# EasyEDA Pro project RBCTL1V2_V1.3.eprj, board ctl1v2pcb
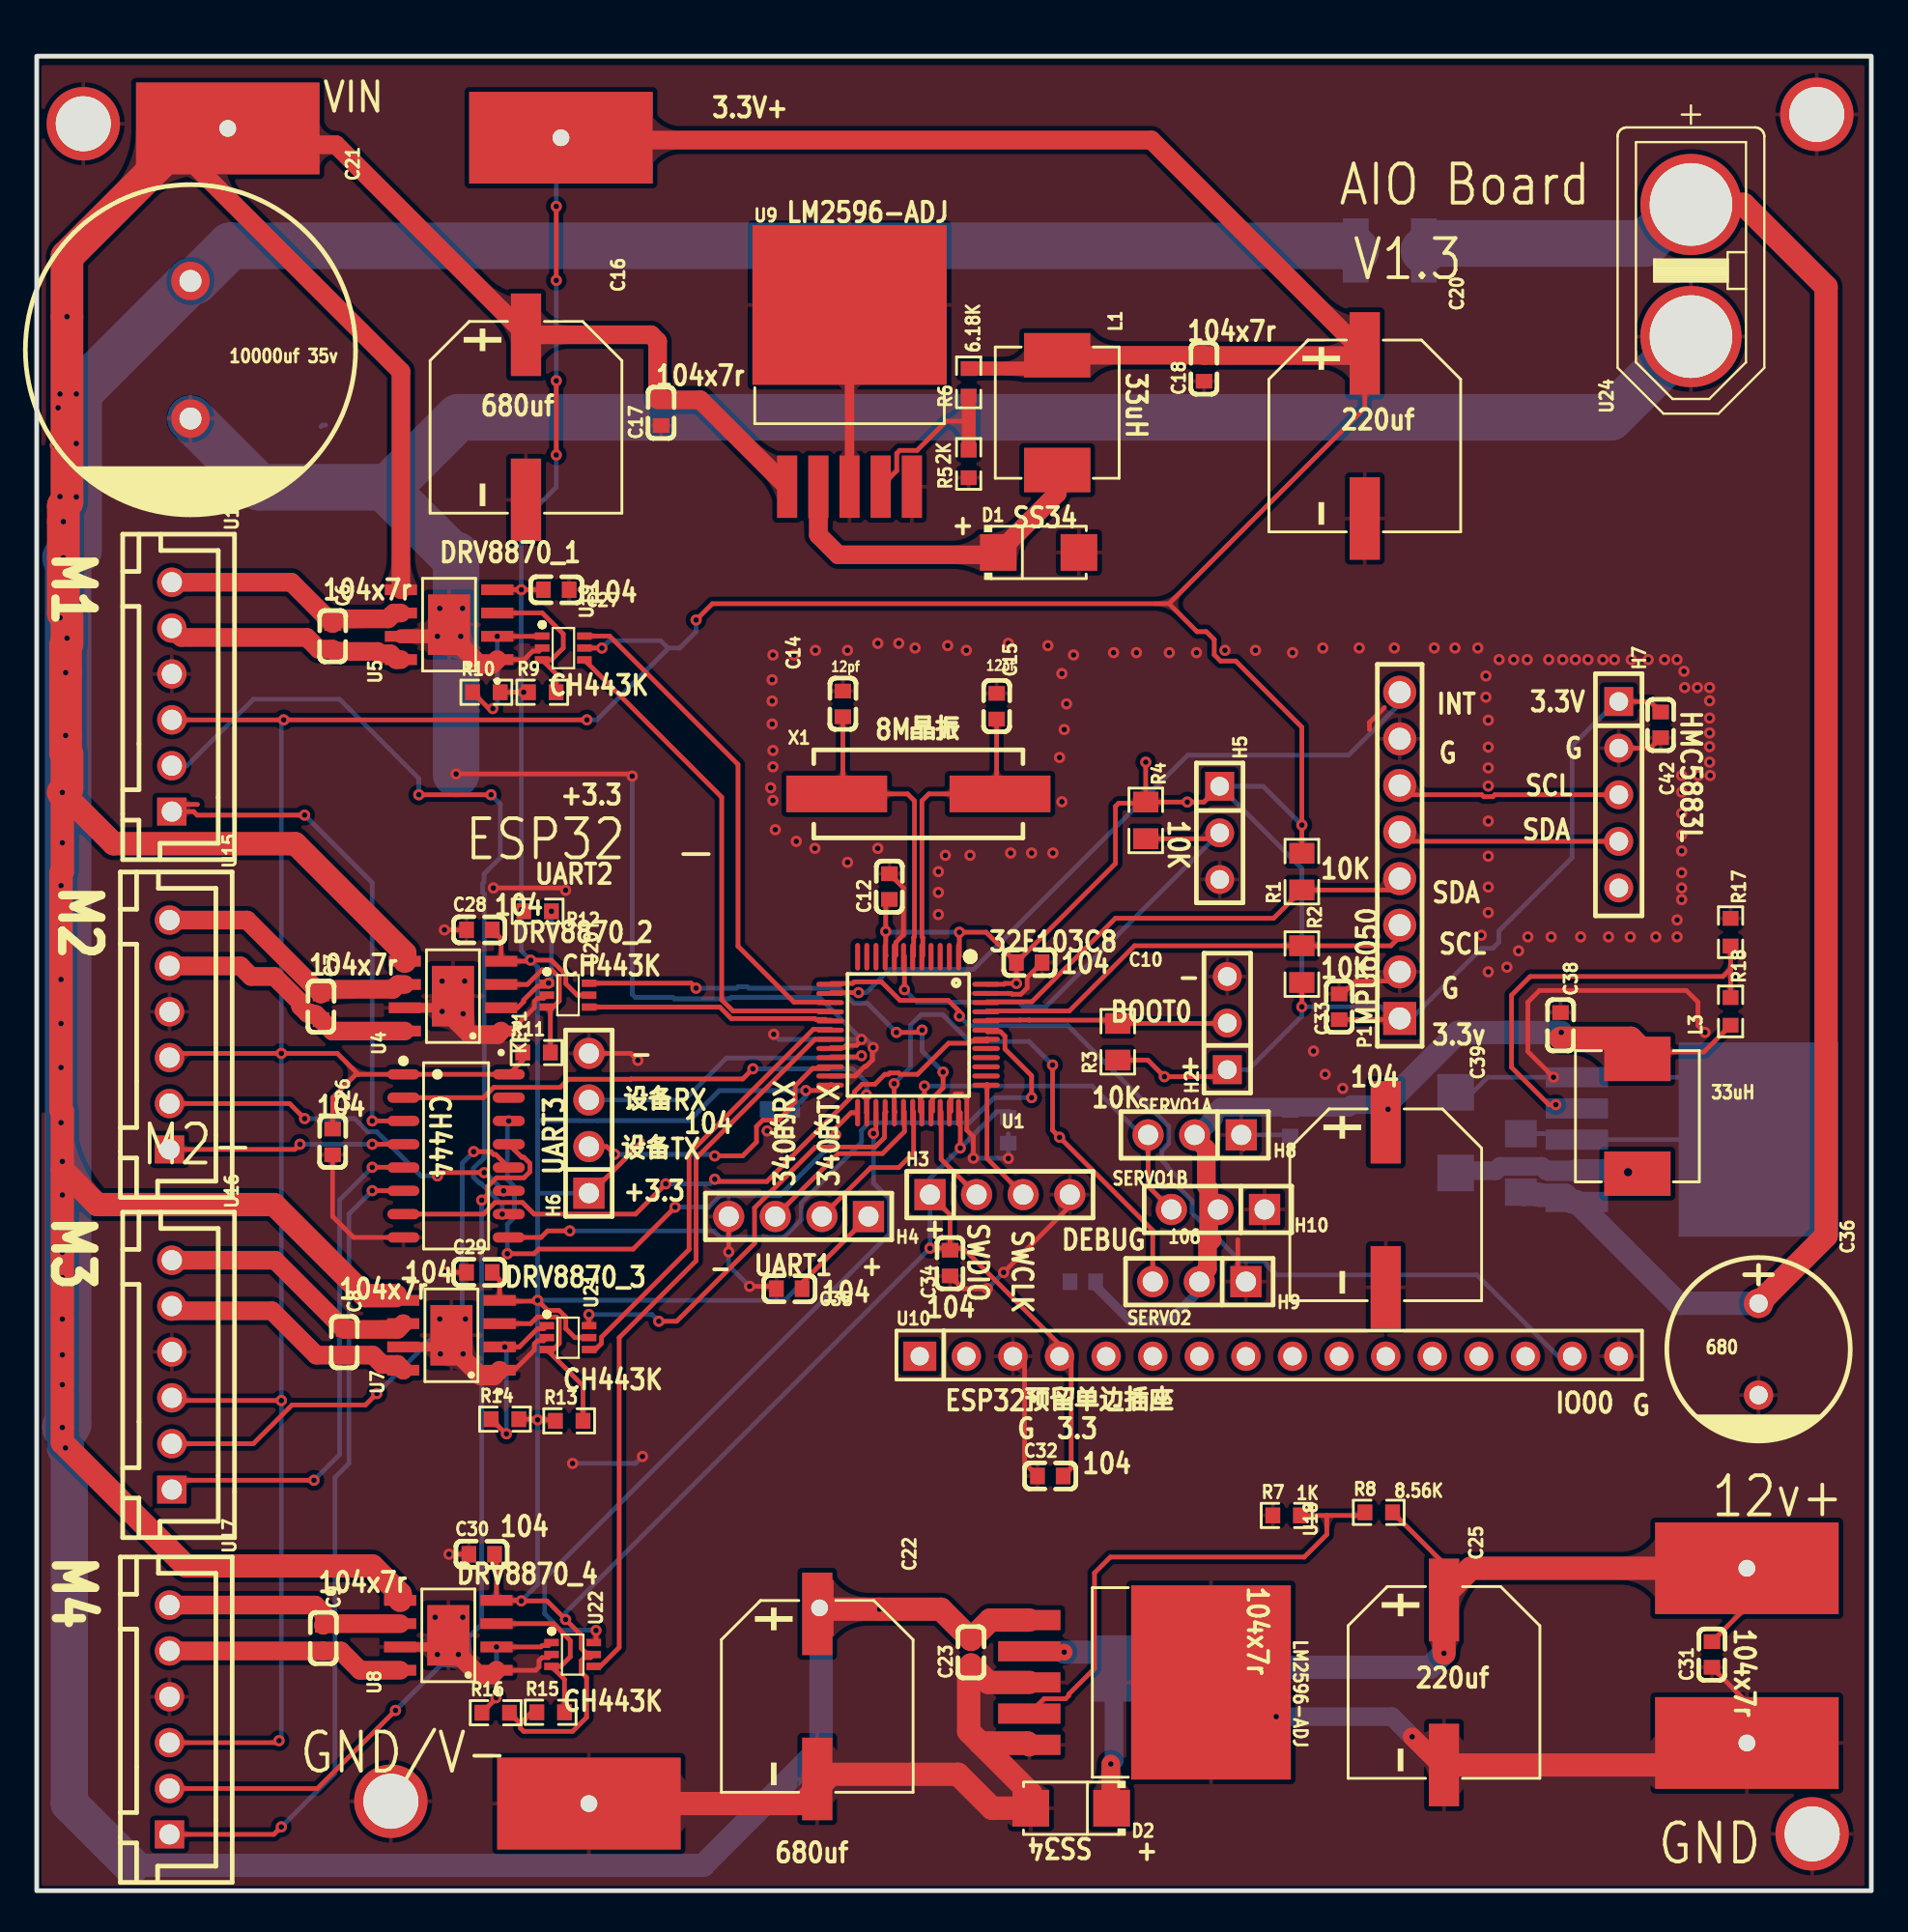
[diagram p1: board, top side]
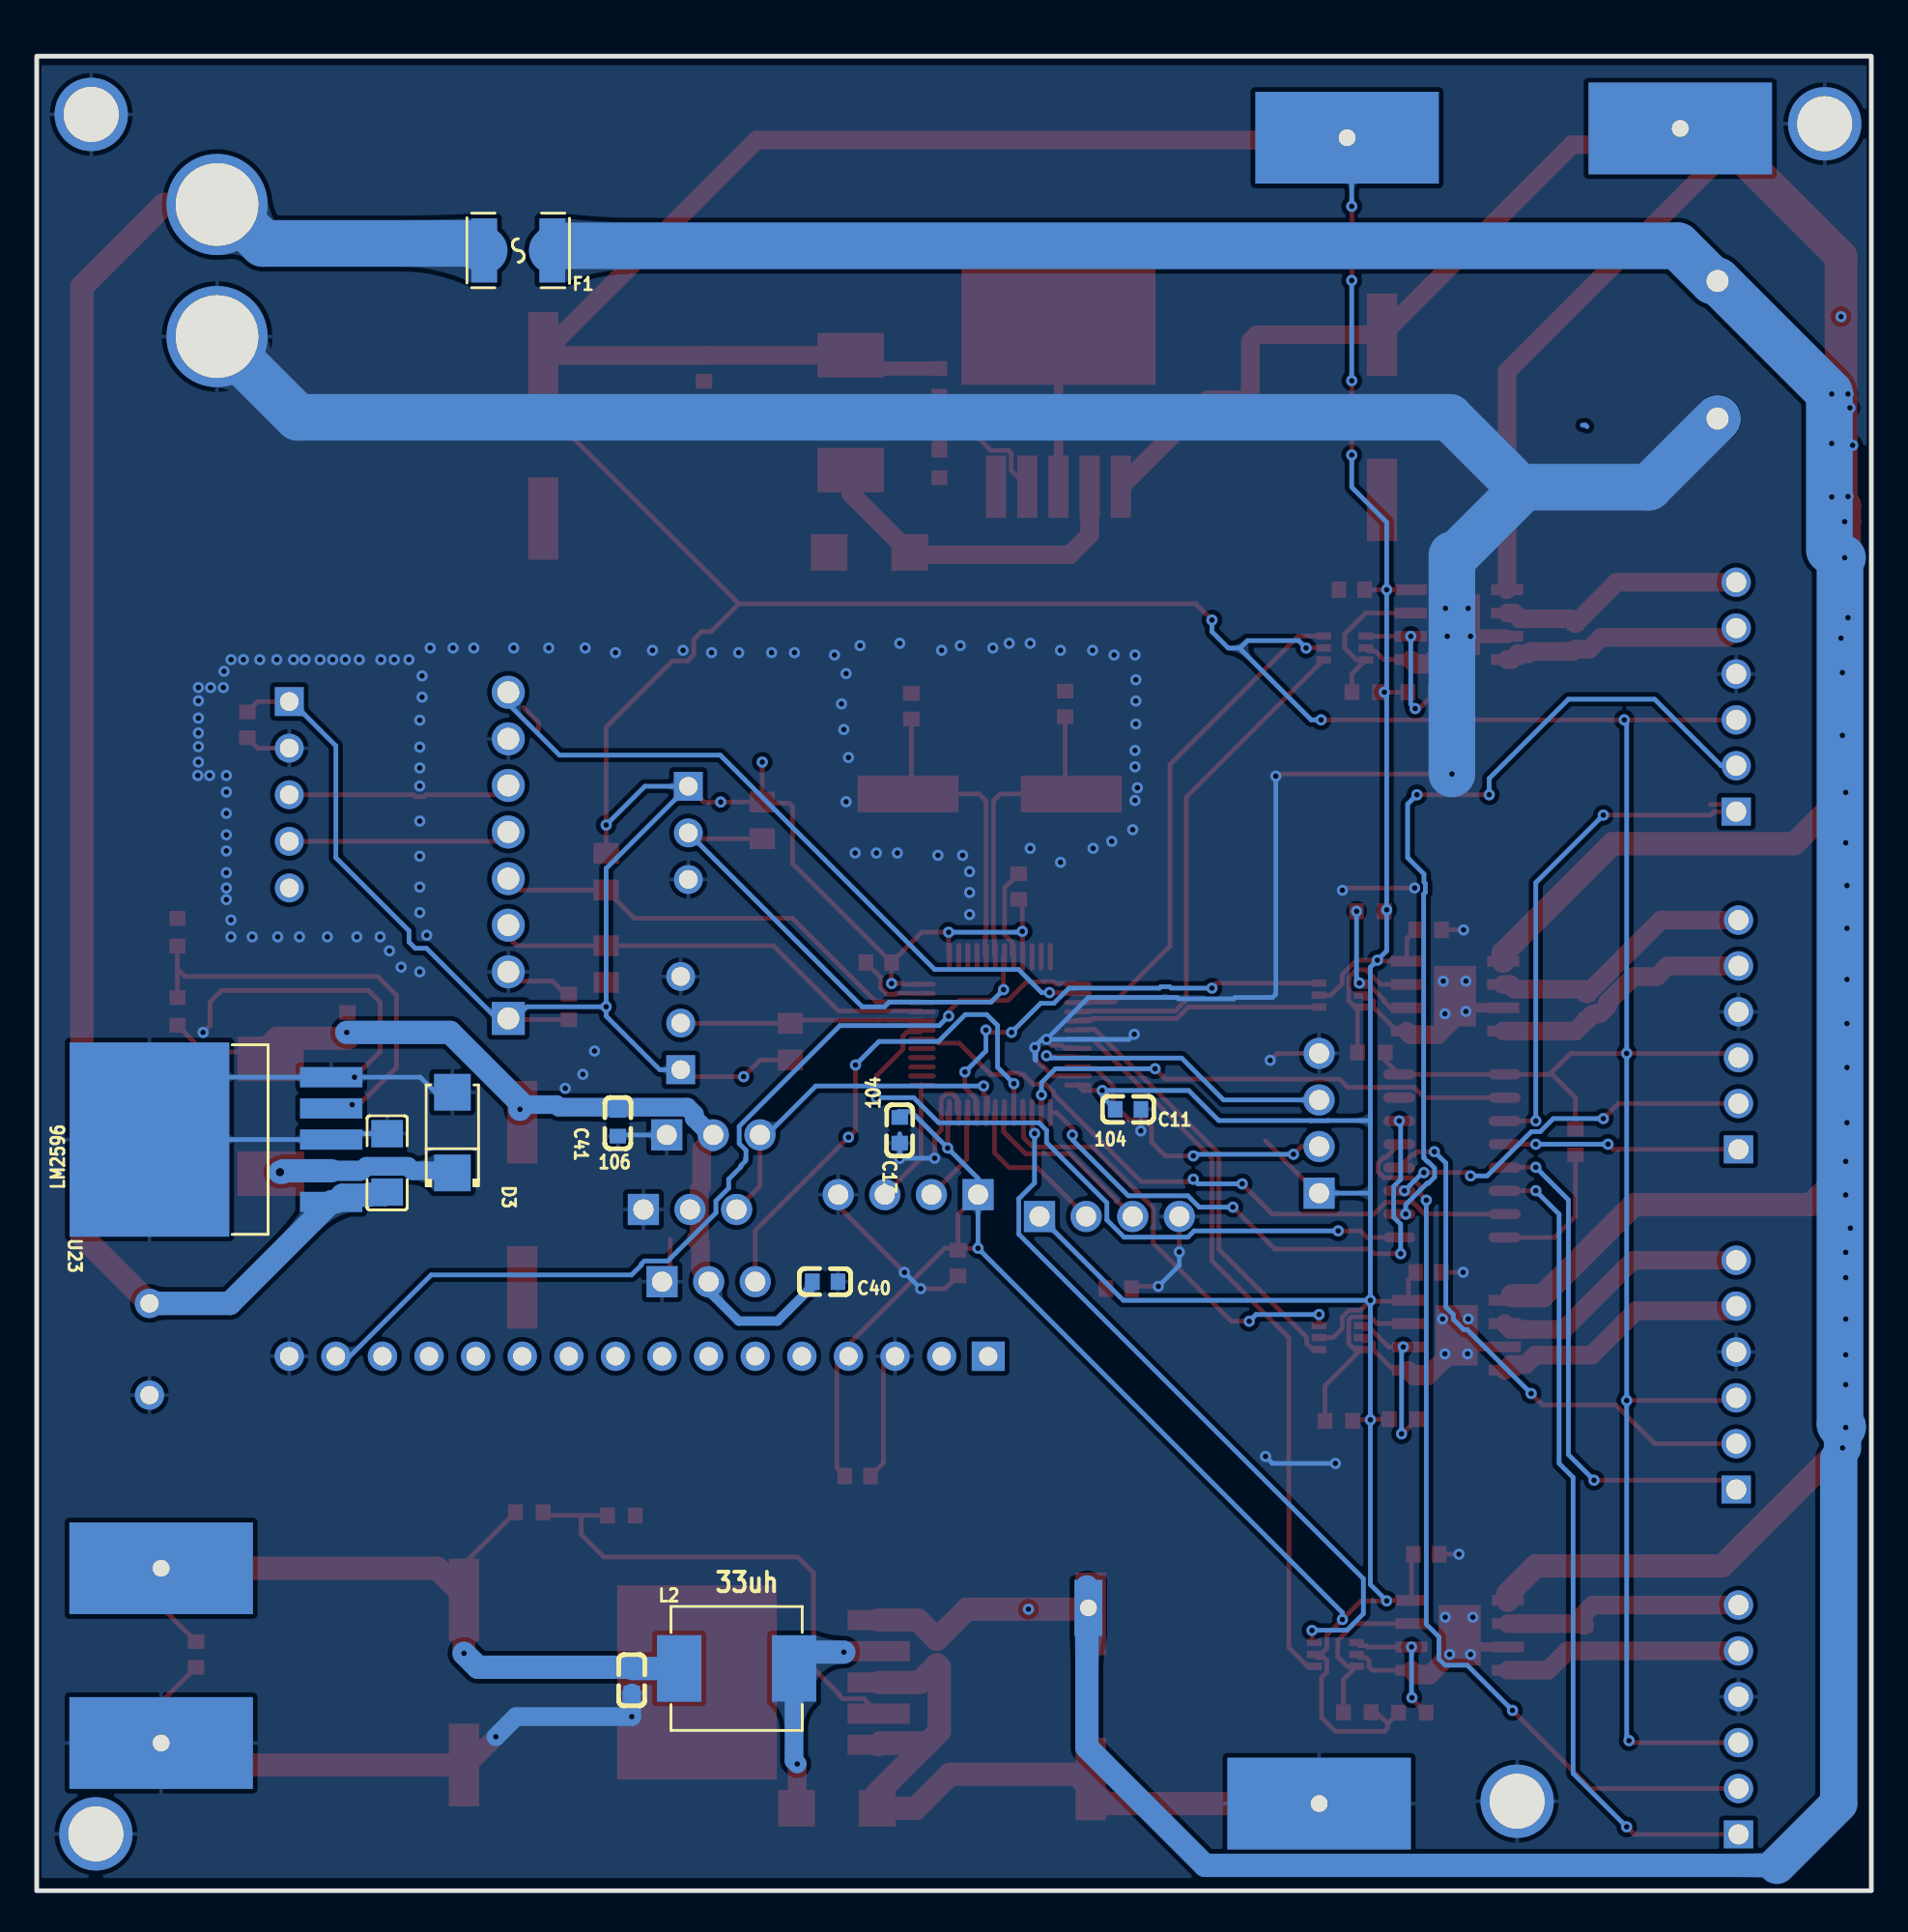
[diagram p2: board, bottom side, seen from below]

Outline 100 x 100 mm; copper layers: Top Layer, Bottom Layer. Coordinates in mm from the lower left corner of the outline.
Outline path: rectangle 0,100 100,0
Stack: Top Layer 0.035mm / Dielectric1 1.51mm FR4 er 4.5 / Bottom Layer 0.035mm

## Design rules (mm)
net $2N1258: DP1
net $2N1262: DP1
template: JLCPCB Capability(Two Layers Board)
spacing copperThickness1oz (default): track to track 0.102, other pairs 0.152 to 0.3
spacing copperThickness2oz: track to track 0.203, other pairs 0.152 to 0.3
track width copperThickness1oz (default): min 0.127, default 0.254, max 2.54
track width copperThickness2oz: min 0.203, default 0.254, max 2.54
differential pair differentialPair (default): width min 0.127, default 0.254, max 2.54; gap min 0.152, default 0.152
via viaSize (default): diameter min 0.5, default 0.61, max 10; hole min 0.3, default 0.305, max 6.3

## Placement (name value [footprint] x y rotation side)
C6  100nF  [C0603]  16.13 68.38 270 top
C7  100nF  [C0603]  15.49 48.18 270 top
C8  100nF  [C0603]  16.76 29.9 270 top
C9  100nF  [C0603]  15.62 13.77 270 top
C10  100nF  [C0603]  54.1 50.6 180 top
C11  100nF  [C0603]  40.51 42.6 0 bottom
C12  100nF  [C0603]  46.48 54.74 90 top
C13  100nF  [C0603]  52.96 41.45 90 bottom
C14  12pF  [C0603]  43.94 64.69 270 top
C15  12pF  [C0603]  52.32 64.57 270 top
C16  680uF  [CAP-SMD_BD10.0-L10.3-W10.3-LS10.9-FD]  26.67 80.31 270 top
C17  100nF  [C0603]  34.04 80.57 90 top
C18  100nF  [C0603]  63.63 82.98 90 top
C20  220uF  [CAP-SMD_BD10.0-L10.3-W10.3-LS10.9-FD]  72.39 79.3 270 top
C21  10000uF  [CAP-TH_BD18.0-P7.50-D0.8-FD]  8.38 84 270 top
C22  680uF  [CAP-SMD_BD10.0-L10.3-W10.3-LS10.9-FD]  42.55 10.59 270 top
C23  100nF  [C0603]  50.93 13 90 top
C24  100nF  [C0603]  67.56 11.48 90 bottom
C25  220uF  [CAP-SMD_BD10.0-L10.3-W10.3-LS10.9-FD]  76.71 11.35 270 top
C26  100nF  [C0603]  16.13 40.82 270 top
C27  100nF  [C0603]  28.32 70.92 180 top
C28  100nF  [C0603]  24.13 52.38 0 top
C29  100nF  [C0603]  24.13 33.71 0 top
C30  100nF  [C0603]  24.26 18.34 0 top
C31  100nF  [C0603]  91.31 12.88 90 top
C32  100nF  [C0603]  55.25 22.61 0 top
C33  100nF  [C0603]  70.99 48.18 270 top
C34  100nF  [C0603]  49.78 34.21 90 top
C35  100nF  [C0603]  41.02 32.82 180 top
C36  680uF  [CAP-TH_BD10.0-P5.00-D0.6-FD]  93.85 29.51 270 top
C37  100nF  [C1206]  80.9 39.67 270 bottom
C38  100nF  [C0603]  83.06 47.17 270 top
C39  220uF  [CAP-SMD_BD10.0-L10.3-W10.3-LS10.9-FD]  73.53 37.39 270 top
C40  10uf  [C0603]  57.02 33.2 180 bottom
C41  10uf  [C0603]  68.33 41.83 270 bottom
C42  100nF  [C0603]  88.52 63.55 90 top
D1  SS34  [SMA_L4.3-W2.6-LS5.2-RD]  54.61 72.95 0 top
D2  SS34  [SMA_L4.3-W2.6-LS5.2-RD]  56.39 4.5 180 top
D3  SS34  [SMA_L4.3-W2.6-LS5.2-RD]  77.34 41.33 90 bottom
F1  15A  [F1812]  73.75 89.41 0 bottom
H2  PM254V-11-03-H85  [HDR-TH_3P-P2.54-V-F]  64.9 47.3 90 top
H3  PZ254V-11-04P  [HDR-TH_4P-P2.54-V-M]  52.5 37.94 0 top
H4  PZ254V-11-04P  [HDR-TH_4P-P2.54-V-M]  41.53 36.75 180 top
H5  PM254V-11-03-H85  [HDR-TH_3P-P2.54-V-F]  64.48 57.66 270 top
H6  PZ254V-11-04P  [HDR-TH_4P-P2.54-V-M]  30.1 41.83 90 top
H7  2.54-1*5P母  [HDR-TH_5P-P2.54-V-F]  86.23 59.74 270 top
H8  PZ254V-11-03P  [HDR-TH_3P-P2.54-V-M]  63.12 41.2 180 top
H9  PZ254V-11-03P  [HDR-TH_3P-P2.54-V-M]  63.37 33.2 180 top
H10  PZ254V-11-03P  [HDR-TH_3P-P2.54-V-M]  64.39 37.14 180 top
KEY1  CH444G  [SOP-16_L10.0-W3.9-P1.27-LS6.0-BL]  22.86 40.06 270 top
L1  33uH  [IND-SMD_L7.0-W6.6_FXL0630]  55.63 80.57 270 top
L2  33uH  [IND-SMD_L7.0-W6.6_FXL0630]  61.85 12.12 180 bottom
L3  33uH  [IND-SMD_L7.0-W6.6_FXL0630]  87.25 42.22 270 top
NOREF  -  [Pad_e30]  30.1 4.75 0 top
NOREF#2  -  [Pad_e2054]  2.54 96.32 0 top
NOREF#3  -  [Pad_e2956]  96.77 3.1 0 top
NOREF#4  -  [Pad_e443]  97.03 96.83 0 top
NOREF#5  -  [Pad_e623]  93.22 17.58 0 top
NOREF#6  -  [Pad_e28]  10.41 96.06 0 top
NOREF#7  -  [Pad_e634]  28.58 95.56 0 top
NOREF#8  -  [Pad_e1183]  42.67 15.42 0 top
NOREF#9  -  [Pad_e2945]  19.3 4.88 0 top
NOREF#10  -  [Pad_e626]  93.22 8.05 0 top
P1  2.54-1*8P母环保  [HDR-TH_8P-P2.54-V-F-1]  74.3 56.44 90 top
R1  10K  [R0805]  68.96 55.55 90 top
R2  10K  [R0805]  68.96 50.51 270 top
R3  10K  [R0805]  58.93 46.28 90 top
R4  10K  [R0805]  60.45 58.34 270 top
R5  2K  [R0603]  50.8 77.78 90 top
R6  6.18K  [R0603]  50.8 82.22 90 top
R7  1K  [R0603]  68.13 20.46 0 top
R8  8.56K  [R0603]  73.15 20.62 0 top
R9  10K  [R0603]  27.56 65.33 0 top
R10  10K  [R0603]  24.51 65.33 0 top
R11  10K  [R0603]  27.25 45.69 0 top
R12  10K  [R0603]  27.31 53.39 180 top
R13  10K  [R0603]  29.02 25.61 0 top
R14  10K  [R0603]  25.53 25.71 0 top
R15  10K  [R0603]  28.02 9.73 0 top
R16  10K  [R0603]  25.02 9.7 0 top
R17  1K  [R0603]  92.33 52.25 270 top
R18  5.1K  [R0603]  92.33 47.93 270 top
U1  STM32F103C8T6  [LQFP-48_L7.0-W7.0-P0.50-LS9.0-BL]  47.5 46.66 180 top
U4  DRV8870DDAR-S  [SOP-8_L4.9-W3.9-P1.27-LS6.0-BL-EP3.3-2]  22.69 48.76 90 top
U5  DRV8870DDAR-S  [SOP-8_L4.9-W3.9-P1.27-LS6.0-BL-EP3.3-2]  22.48 69.01 90 top
U7  DRV8870DDAR-S  [SOP-8_L4.9-W3.9-P1.27-LS6.0-BL-EP3.3-2]  22.61 30.28 90 top
U8  DRV8870DDAR-S  [SOP-8_L4.9-W3.9-P1.27-LS6.0-BL-EP3.3-2]  22.44 13.92 90 top
U9  LM2596S-ADJ  [TO-263-5_L10.2-W8.6-P1.70-LS14.4-BL]  44.31 81.49 0 top
U10  PM254-1-16-Z-8.5  [HDR-TH_16P-P2.54-V-F-A]  67.18 29.13 0 top
U11  ZX-XH2.54-6PZZ  [CONN-TH_6P-P2.50_ZX-XH2.54-6PZZ]  7.37 65.08 270 top
U15  ZX-XH2.54-6PZZ  [CONN-TH_6P-P2.50_ZX-XH2.54-6PZZ]  7.24 46.66 270 top
U16  ZX-XH2.54-6PZZ  [CONN-TH_6P-P2.50_ZX-XH2.54-6PZZ]  7.37 28.12 270 top
U17  ZX-XH2.54-6PZZ  [CONN-TH_6P-P2.50_ZX-XH2.54-6PZZ]  7.24 9.32 270 top
U18  LM2596S-ADJ  [TO-263-5_L10.2-W8.6-P1.70-LS14.4-BL]  59.05 11.35 270 top
U19  CH443K  [SC70-6_L2.1-W1.3-P0.65-LS2.3-BL]  28.7 67.74 270 top
U20  CH443K  [SC70-6_L2.1-W1.3-P0.65-LS2.3-BL]  28.96 48.82 270 top
U21  CH443K  [SC70-6_L2.1-W1.3-P0.65-LS2.3-BL]  28.96 30.15 270 top
U22  CH443K  [SC70-6_L2.1-W1.3-P0.65-LS2.3-BL]  29.21 12.88 270 top
U23  LM2596S-ADJ  [TO-263-5_L10.2-W8.6-P1.70-LS14.4-BL]  88.9 40.94 90 bottom
U24  XT60-F  [CONN-TH_XT60PB-F]  90.17 88.32 90 top
X1  8MHz  [CRYSTAL-SMD_L11.5-W4.8-LS12.7]  48.06 59.79 0 top

## Footprints (pads in the part's own frame, mm; a bottom-side part is the same pattern mirrored in y, then rotated)
C0603
  rect 0.8x0.9 smd: 1(-0.7,0) 2(0.7,0)
C1206
  rect 1.485x1.728 smd: 1(-1.593,0) 2(1.593,0)
CAP-SMD_BD10.0-L10.3-W10.3-LS10.9-FD
  rect 4.5x1.65 smd: 1(-4.5,0) 2(4.5,0)
CAP-TH_BD10.0-P5.00-D0.6-FD
  round 1.6 hole 1: 1(-2.5,0) 2(2.5,0)
CAP-TH_BD18.0-P7.50-D0.8-FD
  round 2.1 hole 1.2: 1(-3.75,0) 2(3.75,0)
CONN-TH_6P-P2.50_ZX-XH2.54-6PZZ
  rect 1.524x1.6 hole 1.1: 1(6.25,0)
  round 1.6 hole 1.1: 2(3.75,0) 3(1.25,0) 4(-1.25,0) 5(-3.75,0) 6(-6.25,0)
CONN-TH_XT60PB-F
  round 5.516 hole 4.505x4.5: +(3.6,0) -(-3.6,0)
CRYSTAL-SMD_L11.5-W4.8-LS12.7
  rect 5.5x2 smd: 1(-4.45,0) 2(4.45,0)
F1812
  rect 1.407x3.499 smd: 1(-1.853,0) 2(1.853,0)
HDR-TH_3P-P2.54-V-F
  rect 1.575x1.575 hole 1.02: 1(-2.54,0)
  round 1.575 hole 1.02: 2(0,0) 3(2.54,0)
HDR-TH_3P-P2.54-V-M
  rect 1.7x1.7 hole 1.1: 1(-2.54,0)
  round 1.7 hole 1.1: 2(0,0) 3(2.54,0)
HDR-TH_4P-P2.54-V-M
  rect 1.7x1.7 hole 1.1: 1(-3.81,0)
  round 1.7 hole 1.1: 2(-1.27,0) 3(1.27,0) 4(3.81,0)
HDR-TH_5P-P2.54-V-F
  rect 1.575x1.575 hole 1.02: 1(-5.08,0)
  round 1.575 hole 1.02: 2(-2.54,0) 3(0,0) 4(2.54,0) 5(5.08,0)
HDR-TH_8P-P2.54-V-F-1
  rect 1.8x1.8 hole 1.2: 1(-8.89,0)
  round 1.8 hole 1.2: 2(-6.35,0) 3(-3.81,0) 4(-1.27,0) 5(1.27,0) 6(3.81,0) 7(6.35,0) 8(8.89,0)
HDR-TH_16P-P2.54-V-F-A
  rect 1.8x1.6 hole 1: 1(-19.05,0)
  round 1.6 hole 1: 2(-16.51,0) 3(-13.97,0) 4(-11.43,0) 5(-8.89,0) 6(-6.35,0) 7(-3.81,0) 8(-1.27,0) 9(1.27,0) 10(3.81,0) 11(6.35,0) 12(8.89,0) 13(11.43,0) 14(13.97,0) 15(16.51,0) 16(19.05,0)
IND-SMD_L7.0-W6.6_FXL0630
  rect 2.424x3.62 smd: 1(3.128,0) 2(-3.128,0)
LQFP-48_L7.0-W7.0-P0.50-LS9.0-BL
  oval 0.27x1.5 smd: 1(-2.75,-4.25) 2(-2.25,-4.25) 3(-1.75,-4.25) 4(-1.25,-4.25) 5(-0.75,-4.25) 6(-0.25,-4.25) 7(0.25,-4.25) 8(0.75,-4.25) 9(1.25,-4.25) 10(1.75,-4.25) 11(2.25,-4.25) 12(2.75,-4.25) 25(2.75,4.25) 26(2.25,4.25) 27(1.75,4.25) 28(1.25,4.25) 29(0.75,4.25) 30(0.25,4.25) 31(-0.25,4.25) 32(-0.75,4.25) 33(-1.25,4.25) 34(-1.75,4.25) 35(-2.25,4.25) 36(-2.75,4.25)
  oval 1.5x0.27 smd: 13(4.25,-2.75) 14(4.25,-2.25) 15(4.25,-1.75) 16(4.25,-1.25) 17(4.25,-0.75) 18(4.25,-0.25) 19(4.25,0.25) 20(4.25,0.75) 21(4.25,1.25) 22(4.25,1.75) 23(4.25,2.25) 24(4.25,2.75) 37(-4.25,2.75) 38(-4.25,2.25) 39(-4.25,1.75) 40(-4.25,1.25) 41(-4.25,0.75) 42(-4.25,0.25) 43(-4.25,-0.25) 44(-4.25,-0.75) 45(-4.25,-1.25) 46(-4.25,-1.75) 47(-4.25,-2.25) 48(-4.25,-2.75)
Pad_e28
  rect 10x5 hole 0.914: 1(0,0)
Pad_e30
  rect 10x5 hole 0.914: 1(0,0)
Pad_e443
  round 4 hole 3: 1(0,0)
Pad_e623
  rect 10x5 hole 0.914: 1(0,0)
Pad_e626
  rect 10x5 hole 0.914: 1(0,0)
Pad_e634
  rect 10x5 hole 0.914: 1(0,0)
Pad_e1183
  rect 1.524x3.048 hole 0.914: 1(0,0)
Pad_e2054
  round 4 hole 3: 1(0,0)
Pad_e2945
  round 4 hole 3: 1(0,0)
Pad_e2956
  round 4 hole 3: 1(0,0)
R0603
  rect 0.806x0.864 smd: 1(-0.753,0) 2(0.753,0)
R0805
  rect 1.133x1.377 smd: 1(-1,0) 2(1,0)
SC70-6_L2.1-W1.3-P0.65-LS2.3-BL
  rect 0.4x0.8 smd: 1(-0.65,-1.15) 2(-0.001,-1.15) 3(0.65,-1.15) 4(0.65,1.15) 5(0,1.15) 6(-0.65,1.15)
SMA_L4.3-W2.6-LS5.2-RD
  rect 2x2 smd: 1(-2.2,0) 2(2.2,0)
SOP-8_L4.9-W3.9-P1.27-LS6.0-BL-EP3.3-2
  rect 0.589x1.75 smd: 1(-1.905,-2.626) 2(-0.635,-2.626) 3(0.635,-2.626) 4(1.905,-2.626) 5(1.905,2.626) 6(0.635,2.626) 7(-0.635,2.626) 8(-1.905,2.626)
  rect 3.3x2.3 smd: 9(0,0)
SOP-16_L10.0-W3.9-P1.27-LS6.0-BL
  oval 0.56x1.745 smd: 1(-4.445,-2.873) 2(-3.175,-2.873) 3(-1.905,-2.873) 4(-0.635,-2.873) 5(0.635,-2.873) 6(1.905,-2.873) 7(3.175,-2.873) 8(4.445,-2.873) 9(4.445,2.873) 10(3.175,2.873) 11(1.905,2.873) 12(0.635,2.873) 13(-0.635,2.873) 14(-1.905,2.873) 15(-3.175,2.873) 16(-4.445,2.873)
TO-263-5_L10.2-W8.6-P1.70-LS14.4-BL
  rect 1.1x3.4 smd: 1(-3.4,-4.953) 2(-1.7,-4.953) 3(0,-4.953) 4(1.7,-4.953) 5(3.4,-4.953)
  rect 10.587x8.705 smd: 6(0,4.953)

## Nets
As in the schematic, except:
GND: C10.1 C11.1 C12.2 C13.1 C14.1 C15.1 C16.2 C17.1 C18.1 C20.2 C21.2 C22.2 C23.1 C24.1 C25.2 C26.2 C27.1 C28.1 C29.1 C30.1 C31.1 C32.1 C33.1 C34.1 C35.2 C36.2 C37.1 C38.1 C39.2 C40.2 C41.2 C42.1 D1.2 D2.2 D3.2 H2.3 H3.4 H4.4 H5.3 H6.4 H7.2 H8.1 H9.1 H10.1 KEY1.8 NOREF.1 NOREF#2.1 NOREF#3.1 NOREF#4.1 NOREF#9.1 NOREF#10.1 P1.2 P1.7 R5.1 R7.1 R17.1 U1.8 U1.20 U1.23 U1.35 U1.47 U4.1 U4.7 U4.9 U5.1 U5.7 U5.9 U7.1 U7.7 U7.9 U8.1 U8.7 U8.9 U9.3 U9.5 U9.6 U10.3 U10.16 U11.4 U15.4 U16.4 U17.4 U18.3 U18.5 U18.6 U19.2 U20.2 U21.2 U22.2 U23.3 U23.5 U23.6 U24.-
VCC12: C24.2 C25.1 C31.2 L2.2 NOREF#5.1 R8.2
VCC12I: C16.1 C17.2 C21.1 C22.1 C23.2 F1.1 NOREF#6.1 NOREF#8.1 U4.5 U5.5 U7.5 U8.5 U9.1 U18.1
VCC33: C10.2 C11.2 C12.1 C13.2 C18.2 C20.1 C26.1 C27.2 C28.2 C29.2 C30.2 C32.2 C33.2 C34.2 C35.1 C42.2 H2.1 H3.1 H4.1 H5.1 H6.1 H7.1 KEY1.1 KEY1.16 L1.2 NOREF#7.1 P1.1 R1.2 R2.2 R3.1 R4.1 R6.2 R9.1 R10.2 R11.1 R12.2 R13.1 R14.2 R15.1 R16.2 U1.1 U1.9 U1.24 U1.36 U1.48 U4.4 U5.4 U7.4 U8.4 U10.4 U11.3 U15.3 U16.3 U17.3 U19.5 U20.5 U21.5 U22.5
H1BB: KEY1.10 U11.2
H2BB: KEY1.11 U15.2
H3BB: KEY1.12 U16.2
H4BB: KEY1.13 U17.2

Pads without a net: H7 5; KEY1 15; U1 2 3 4 38 39 40 41; U10 1 2 5 6 7 8 9 10 11 12 13 14

## Via types
v1: diameter 0.61, hole 0.305, Top Layer to Bottom Layer, 267 vias
v2: diameter 0.914, hole 0.305, Top Layer to Bottom Layer, 4 vias
v3: diameter 1.016, hole 0.457, Top Layer to Bottom Layer, 1 via

## Routing (per net, layer and track width the routed paths; a pad name or vN(x,y) marks a point on that pad's centre or on a via; arc(x,y) is an arc through that point)
GND: length 399.2
  Top Layer w0.254: 74.42,49.58 71.88,49.58 71.19,48.88 C33.1 ; C34.1 50.48,32.82 v1(51.82,32.82) ; v1(22.47,18.34) 23.55,18.34 C30.1 ; v1(45.59,45.96) 45.54,45.91 45.54,45.28 45.2,44.93 45.14,44.93 44.61,44.41 U1.23 ; v1(90.93,46.79) 90.55,47.17 90.55,48.44 89.92,49.07 81.92,49.07 81.28,48.44 81.28,45.74 v1(82.68,44.34) ; H9.1 65.47,33.64 65.47,35.48 ; C31.1 93.22,10.27 93.22,7.42 ; v1(28.83,54.53) 28.7,54.66 v1(24.89,54.66) ; H7.2 87.95,62.28 C42.1 ; U7.1 26.03,28.37 27.13,29.47 27.13,29.82 27.29,29.98 27.64,29.98 U21.2 ; v1(38.86,32.94) 40.19,32.94 C35.2 ; 65.79,41.64 65.79,40.44 ; KEY1.8 17.27,35.61 16.13,36.75 C26.2 ; U1.47 53.12,48.91 53.16,48.87 53.65,48.87 53.99,49.21 53.99,49.78 C10.1 ; U1.8 46.83,51 46.83,51.7 47.24,52.11 47.24,54.67 C12.2 ; v1(51.05,39.93) 51.05,41.1 50.7,41.46 50.7,43.16 50.42,43.44 50.08,43.44 49.83,43.2 49.83,42.5 U1.35 ; v1(52.7,33.71) 56.31,37.31 H3.4 ; H4.4 v1(37.72,34.82) ; U20.2 27.64,48.65 27.29,48.65 27.13,48.48 27.13,48.14 25.85,46.86 U4.1 ; U22.2 27.89,12.71 27.54,12.71 27.38,12.54 27.38,12.2 27.2,12.02 U8.1 ; 72.64,63.3 72.64,63.68 73.46,64.5 ; C29.1 23.42,33.71 v1(22.25,33.71) ; v1(44.96,46.41) 44.84,46.29 44.84,46.23 44.7,46.08 44.12,46.08 44,45.96 43.3,45.96 ; U5.1 26.57,67.11 27.04,67.57 27.38,67.57 U19.2 ; 54.55,22.61 53.85,23.31 53.85,29.13 ; v1(22.86,60.87) 32.34,60.87 v1(32.46,60.76) ; v1(32.77,45.26) 32.39,45.64 H6.4 ; v1(22.23,52.38) C28.1
  Top Layer w0.508: U7.7 21.97,29.64 U7.9 ; U4.9 22.06,48.13 U4.7 ; U8.7 21.8,13.29 U8.9 ; U9.6 U9.3
  Top Layer w0.762: U5.9 v1(21.84,68.38) U5.7
  Top Layer w1.016: U4.1 25.12,46.66 23.62,46.66 22.69,47.59 U4.9 ; 76.58,6.98 76.38,6.98 v1(74.97,8.39) ; U5.9 22.48,68.5 24.13,66.85 24.85,66.85 U5.1 ; U7.1 24.91,28.05 24.19,28.05 22.61,29.64 U7.9 ; U8.9 22.44,13.41 24.09,11.76 24.81,11.76 U8.1
  Top Layer w1.27: 42.93,6.35 50.22,6.35 52.07,4.5 D2.2 54.19,5.3 51.44,8.05 ; U18.3 51.88,11.35 C23.1 50.8,12.18 50.8,8.69 51.44,8.05 ; 93.22,7.42 92.66,6.85 C25.2 ; 51.44,8.05 54,8.05 U18.5 ; 43.18,6.22 41.71,4.75 NOREF.1
  Bottom Layer w0.254: v1(40.17,46.69) 40.45,46.41 v1(44.96,46.41) ; 52.96,39.92 v1(52.96,39.92) ; 52.96,39.92 52.95,39.93 v1(51.05,39.93) ; 52.96,39.92 C13.1 52.96,41.26 ; v1(45.59,45.96) 45.59,45.33 45.54,45.28 45.54,46.08 45.21,46.41 v1(44.96,46.41) ; v1(32.46,60.76) 32.46,48.87 32.64,48.69 34.67,48.69 34.75,48.62 37.77,48.62 37.85,48.69 42.67,48.69 v1(44.96,46.41) ; v1(33.02,23.67) 32.64,23.29 v1(29.21,23.29) ; v1(38.86,32.94) 37.72,34.09 v1(37.72,34.82) ; D3.2 78.27,43.53 79.09,44.34 v1(82.68,44.34) U23.5 90.45,44.34 U23.6 U23.3 83.62,41.27 C37.1 ; v1(52.7,33.71) v1(51.82,32.82) ; C41.2 68.26,41.2 H8.1
  Bottom Layer w1.016: C24.1 v2(67.56,9.49) 73.87,9.49 v1(74.97,8.39)
  Bottom Layer w2.54: 18.92,76.5 12.12,76.5 C21.2 ; 19.69,77.01 22.99,80.31 85.77,80.31 90.17,84.72 ; 19.05,76.38 22.48,72.95 ; 22.86,72.82 v1(22.86,60.87)
  vias: v1(21.72,14.91) v1(21.84,12.88) v1(21.97,69.9) v1(21.97,31.17) v1(22.1,49.58) v1(22.1,47.93) v1(22.01,29.26) v1(22.99,12.88) v1(23.11,68.38) v1(23.21,69.9) v1(23.24,47.8) v1(23.24,29.26) v1(23.22,14.91) v1(23.33,49.58) v1(23.37,31.17) v1(39.82,41.42) v1(40.09,66.01) v1(40.09,64.85) v1(40.09,63.6) v1(40.01,60.12) v1(40.13,67.36) v1(40.13,62.15) v1(40.13,61.27) v1(40.13,59.43) v1(40.26,57.84) v1(41.27,67.36) v1(41.4,57.2) v1(42.45,67.61) v1(42.42,56.82) v1(44.2,67.61) v1(44.2,56.06) v1(45.85,68) v1(45.85,56.82) v1(46.99,68) v1(47.88,67.74) v1(49.15,55.55) v1(49.15,54.41) v1(49.15,53.21) v1(49.53,56.44) v1(49.66,67.87) v1(50.67,67.61) v1(50.87,56.44) v1(52.96,68) v1(53.09,56.57) v1(54.23,56.57) v1(55.12,67.87) v1(55.39,56.57) v1(55.75,61.77) v1(55.88,66.34) v1(55.88,59.36) v1(56.01,63.3) v1(56.13,64.69) v1(56.52,67.36) v1(58.7,67.49) v1(59.94,67.49) v1(61.74,67.49) v1(63.22,67.49) v1(64.77,67.61) v1(66.43,67.61) v1(68.45,67.49) v1(69.6,45.77) v1(70.1,67.74) v1(70.23,44.5) v1(71.19,43.74) v1(72.09,67.74) v1(74,67.74) v1(76.18,67.74) v1(77.31,67.74) v1(78.55,67.74) v1(78.74,52.08) v1(78.99,66.22) v1(78.99,65.06) v1(79.12,63.81) v1(79.12,62.34) v1(79.12,61.2) v1(79.12,60.22) v1(79.12,58.31) v1(79.12,56.39) v1(79.12,54.71) v1(79.12,53.32) v1(79.12,50.09) v1(79.71,67.11) v1(80.14,50.34) v1(80.51,67.11) v1(80.77,51.23) v1(81.24,67.11) v1(81.28,51.99) v1(82.42,67.11) v1(82.55,51.99) v1(83.18,67.11) v1(83.87,67.11) v1(84.16,51.99) v1(84.56,67.11) v1(85.37,67.11) v1(85.68,51.99) v1(86,67.11) v1(86.86,51.99) v1(86.91,67.11) v1(87.84,67.11) v1(88.25,51.99) v1(88.73,67.11) v1(89.41,67.11) v1(89.41,52.92) v1(89.41,51.99) v1(89.66,60.79) v1(89.66,59.89) v1(89.66,58.72) v1(89.66,57.56) v1(89.66,56.68) v1(89.66,55.49) v1(89.66,54.66) v1(89.66,54.03) v1(89.79,66.47) v1(89.83,65.58) v1(90.52,65.58) v1(90.57,60.79) v1(91.19,65.58) v1(91.19,64.86) v1(91.19,63.92) v1(91.19,63.11) v1(91.19,62.36) v1(91.19,61.52) v1(91.22,60.79)
VCC12: length 42.8
  Top Layer w0.254: R8.2 76.58,17.95 76.58,15.98 ; NOREF#5.1 93.22,15.48 91.31,13.58
  Top Layer w1.27: 76.58,15.98 78.18,17.58 NOREF#5.1 ; C25.1 v2(76.71,12.94)
  Bottom Layer w1.27: v2(76.71,12.94) 75.95,12.18 C24.2 67.5,12.12 L2.2
VCC12I: length 426.1
  Top Layer w1.016: C17.2 36.17,81.27 U9.1 ; 33.84,81.27 33.84,84.45 33.48,84.81 C16.1 16.31,95.17 7.49,95.17 19.85,82.81 U5.5
  Top Layer w1.27: 1.4,39.31 3.3,37.4 12.94,37.4 17.91,32.44 19.56,32.44 ; 1.4,39.31 v1(1.4,37.93) v1(1.4,34.8) v1(1.4,33.42) v1(1.4,31.16) v1(1.4,29.21) v1(1.4,27.59) v1(1.4,25.25) 1.4,24.44 8.13,17.7 18.29,17.7 19.81,16.18 U8.5 ; 1.4,39.31 v1(1.4,39.75) 1.4,42.49 1.33,42.56 v1(1.33,44.87) v1(1.33,47.27) v1(1.33,49.67) v1(1.33,52.46) v1(1.33,54.79) 1.33,55.48 1.4,55.55 v1(1.4,57.12) v1(1.4,59.87) 4.19,57.07 14.1,57.07 20.07,51.11 U4.5 ; U18.1 51.98,14.75 C23.2 49.29,15.35 v1(45.94,15.35) 42.93,15.35
  Top Layer w1.778: 1.44,59.87 1.65,60.08 1.65,61.94 1.58,62.02 v1(1.58,62.97) v1(1.58,66.4) 1.58,67.88 1.65,67.95 v1(1.65,68.27) 1.65,69.44 1.45,69.64 v1(1.45,72.66) v1(1.45,74.63) 1.45,75.5 1.65,75.7 v1(1.65,85.8) 1.65,89.08 7.49,94.92
  Bottom Layer w1.27: 5.14,1.38 36.32,1.38 42.76,7.82 42.76,16.56
  Bottom Layer w2.032: 1.78,23.55 1.78,4.75 5.14,1.38 ; 1.57,24.82 v1(1.57,24.13)
  Bottom Layer w2.54: 1.57,25.25 1.57,25.3 1.71,25.43 1.71,72.53 1.57,72.66 ; F1.1 71.65,89.67 10.55,89.67 8.64,87.75 C21.1 2.29,81.65 2.29,73.08
  vias: v1(1.02,78.79) v1(1.16,80.83) v1(1.14,36.12) v1(1.27,81.58) v1(1.27,76) v1(1.27,69.39) v1(1.33,41.87) v1(2.16,81.58) v1(2.16,78.89) v1(2.16,75.98)
VCC33: length 594.3
  Top Layer w0.254: 53.34,49.46 53.4,49.52 C10.2 ; 53.34,49.46 52.78,49.46 52.73,49.41 U1.48 ; 53.34,49.46 53.4,49.46 v1(53.4,49.45) ; 50.3,42.46 50.34,42.41 v1(50.34,40.48) ; C30.2 25.06,18.23 U8.4 26.39,15.83 v1(26.42,15.8) 27.81,15.8 v1(28.83,14.78) 29.68,13.93 29.68,13.21 30.02,12.88 U22.5 30.19,12.71 29.84,12.71 29.68,12.54 29.68,11.91 29.97,11.62 29.97,9.45 29.21,8.69 26.54,8.69 26.36,8.87 26.36,9.11 ; 17.53,44.5 17.4,44.5 16.13,43.23 C26.1 ; 17.53,44.5 16.38,45.64 v1(13.34,45.64) 7.47,45.64 U15.3 ; 17.53,44.5 KEY1.1 KEY1.16 26.49,45.26 R11.1 ; U21.5 29.34,30.15 28.84,30.65 28.84,31.26 28.47,31.64 27.85,31.64 v1(27.31,32.18) 27.26,32.14 25.82,32.14 ; H5.1 63.62,59.34 v1(62.72,59.34) R4.1 ; 74.42,47.04 73.98,47.48 C33.2 ; 26.36,9.11 26.98,9.73 R15.1 ; 26.36,9.11 R16.2 ; C10.2 51.75,52.25 v1(50.29,52.25) 50.29,50.95 U1.1 ; C10.2 58.8,56 58.8,59.11 58.98,59.29 60.39,59.29 R4.1 ; v1(28.32,82.31) v1(28.32,78.26) ; R13.1 28.21,25.67 v1(27.31,25.67) 27.27,25.71 R14.2 ; C29.2 25.23,33.3 25.23,32.18 ; R4.1 v1(60.45,61.52) ; v1(48.69,35.02) 50.5,35.02 56.39,29.13 56.39,23.04 C32.2 ; 46.3,50.96 46.28,50.98 v1(46.28,52.29) 46.28,53.84 C12.1 ; U5.4 v1(26.42,70.92) C27.2 ; 61.72,70.16 72.39,80.82 C20.1 ; 61.72,70.16 63.25,68.63 63.75,68.63 64.19,68.2 64.19,67.37 64.53,67.03 65.35,67.03 68.96,63.42 v1(68.96,58.09) R1.2 ; 61.72,70.16 36.83,70.16 v1(35.94,69.27) ; 68.96,49.51 v1(68.96,48.18) ; C28.2 25.32,51.89 U4.4 26.87,50.67 v1(26.92,50.72) 28.05,50.72 28.84,49.93 28.84,49.44 29.46,48.82 U20.5 ; H7.1 87.95,64.82 C42.2 ; v1(41.92,43.62) 42.96,43.62 43.3,43.96 ; H6.1 30.2,38.02 32.08,39.9 32.08,39.94 33.02,40.88 ; v1(29.99,63.82) v1(13.47,63.82) U11.3 ; H2.1 64.52,44.37 v1(61.47,44.37) 60.56,45.28 R3.1 ; 41.72,32.82 41.72,33.14 H4.1 ; v1(13.34,26.72) 7.51,26.72 U16.3 ; 49.78,35.17 49.78,36.85 H3.1 ; v1(28.32,91.81) v1(28.32,87.78) ; U19.5 30.8,67.74 v1(30.81,67.74) ; U17.3 13.1,8.07 v1(13.21,8.18) ; R10.2 v1(26.54,65.33)
  Top Layer w0.762: L1.2 54.9,82.97 R6.2
  Top Layer w1.016: 28.45,95.43 60.76,95.43 C20.1 72.27,83.68 C18.2 63.61,83.7 L1.2
  Bottom Layer w0.254: v1(68.96,58.09) 66.85,60.2 H5.1 68.96,55.72 v1(68.96,48.18) ; v1(35.94,69.27) 35.94,68.63 35.05,67.74 34.44,67.74 ; v1(68.96,48.18) 68.96,47.68 66.04,44.75 H2.1 ; v1(68.96,48.18) 73.28,48.18 74.42,47.04 78.75,51.37 79.36,51.37 79.7,51.71 79.7,52.32 83.69,56.31 83.69,62.41 86.11,64.82 H7.1 ; 27.31,38.09 v1(27.31,32.18) ; 27.31,38.09 27.31,41.98 ; 27.31,38.09 27.37,38.02 H6.1 ; v1(27.31,32.18) 40.77,32.18 H4.1 ; v1(27.31,32.18) v1(27.31,25.67) 27.31,16.69 v1(26.42,15.8) ; 27.31,41.98 29.62,41.98 29.63,41.97 30.57,41.97 30.57,41.98 35.57,41.98 37.2,43.62 v1(41.92,43.62) 41.92,43.31 41.21,42.6 ; 27.31,41.98 27.31,50.34 v1(26.92,50.72) 26.42,51.23 v1(26.42,53.47) v1(26.42,70.92) 26.42,74.6 28.32,76.5 v1(28.32,78.26) ; v1(28.83,14.78) 28.83,15.16 v1(48.69,35.02) H3.1 48.69,38.83 v1(50.34,40.48) 52.33,42.47 53.02,42.47 53.15,42.34 ; v1(50.29,52.25) 46.33,52.25 v1(46.28,52.29) ; v1(13.47,63.82) 13.34,63.69 v1(13.34,45.64) v1(13.34,26.72) 13.34,8.31 v1(13.21,8.18) ; 28.32,94.54 v1(28.32,91.81) ; v1(28.32,87.78) v1(28.32,82.31) ; 34.44,67.74 30.53,63.82 v1(29.99,63.82) ; 34.44,67.74 34.41,67.74 34.01,68.14 31.21,68.14 v1(30.81,67.74)
VCC74: length 49.9
  Top Layer w0.254: 87.63,45.72 90.88,45.72 R18.2
  Top Layer w1.016: H9.2 63.37,33.45 63.82,33.89 63.82,35.23 64.07,35.48 63.88,35.67 63.88,38.28 63.75,38.41 63.75,40.44 63.12,41.07 H8.2
  Top Layer w1.27: C38.2 86.89,46.47 87.63,45.72
  Bottom Layer w0.508: C40.1 57.72,32.94 59.61,31.05 61.74,31.05 63.37,32.69 H9.2
  Bottom Layer w1.016: 63.12,40.82 63.12,41.07 64.15,42.1 64.15,42.32 64.54,42.71 71.52,42.71 71.67,42.85 73.41,42.85 v1(73.66,42.6)
  Bottom Layer w1.27: v1(83.1,46.79) 77.47,46.79 73.66,42.98 v1(73.66,42.6)
(no net): length 0.3
  Bottom Layer w0.254: 15.75,79.89 15.58,79.89 15.49,79.81
444_INPUT1: length 36.6
  Top Layer w0.254: v1(34.29,38.53) 32.64,36.88 27.12,36.88 26.48,37.52 24.98,37.52 24.35,36.88 KEY1.7 ; v1(36.96,38.79) 37.08,38.66 39.8,38.66 44.58,43.44 44.58,43.55 44.99,43.96 45.69,43.96 46.23,44.5 46.42,44.5 46.49,44.58 46.98,44.58 47.05,44.5 48.01,44.5 49.7,46.2 50.83,46.2 50.96,46.32 51.79,46.32 51.8,46.33 51.8,46.46
  Bottom Layer w0.254: v1(34.29,38.53) 36.7,38.53 v1(36.96,38.79)
444_INPUT2: length 37.9
  Top Layer w0.254: v1(29.06,35.97) 27.85,35.97 27.49,35.61 KEY1.9 ; v1(54.23,43.23) 54.23,44.43 52.78,45.88 52.78,46.58 52.53,46.82 51.83,46.82 U1.43
  Bottom Layer w0.254: v1(29.06,35.97) 36.91,35.97 37.25,35.62 40.73,35.62 41.67,36.57 41.67,37.5 44.95,40.79 44.95,41.45 45.37,41.86 50.83,41.86 52.2,43.23 54.1,43.23
444_SEL1: length 30.2
  Top Layer w0.254: U1.25 44.39,42.41 43.55,41.57 v1(43.55,41.2) ; v1(25.65,34.72) 27.11,34.72 27.36,34.98 32.51,34.98 v1(34.8,37.26)
  Bottom Layer w0.254: v1(43.55,41.2) 43.55,40.93 40.5,37.88 37.25,37.88 36.63,37.26 v1(34.8,37.26) ; v1(25.65,34.72) 25.65,36.33 26.04,36.71 26.04,38.39 25.65,38.77 25.65,41.88 v1(25.73,41.96)
444_SEL2: length 27.9
  Top Layer w0.254: v1(39.04,44.81) 38.48,44.25 32.39,44.25 32.37,44.23 28.98,44.23 28.53,43.79 24.91,43.79 24.35,43.23 KEY1.2 ; U1.26 45.23,42.43 v1(45.23,43.38)
  Bottom Layer w0.254: v1(45.23,43.38) 45.23,44.04 44.47,44.81 v1(39.04,44.81)
BOOTSEL: length 13.2
  Top Layer w0.254: H2.2 64.88,47.28 R3.2 58.75,47.46 54.09,47.46 54.09,47.46 53.61,47.46 53.6,47.46 51.8,47.46
CH340_RX: length 10
  Top Layer w0.254: H4.3 43.69,40.18 46.1,40.18 47.3,41.38 47.3,42.46
CH340_TX: length 8.7
  Top Layer w0.254: 47.8,42.46 47.8,40.23 46.99,39.42 45.47,39.42 42.8,36.75
ESP_TX: length 52.5
  Top Layer w0.254: 43.3,49.46 44.47,49.46 44.56,49.54 46.05,49.54 47.06,48.53 49.69,48.53 50.29,47.93 v1(50.29,47.68)
  Bottom Layer w0.254: 84.33,29.13 83.81,28.62 83.45,28.62 78.5,33.57 67.58,33.57 67.04,34.1 67.04,34.16 66.88,34.33 65.6,34.33 62.98,36.95 62.98,37.6 62.28,38.3 62.28,38.79 61.62,39.45 61.62,39.52 61.35,39.79 61.35,39.92 61.34,39.93 61.34,40.36 61.71,40.73 61.71,41.67 56.22,47.16 50.81,47.16 v1(50.29,47.68)
FB: length 9.8
  Top Layer w0.254: 50.8,80.1 49.57,80.1 47.98,78.51 47.04,78.51 46.88,78.35 46.88,77.4 U9.4
  Top Layer w0.762: R6.1 R5.2
FB2: length 28
  Top Layer w0.254: U18.4 54.91,10.47 56.08,10.47 56.26,10.64 56.26,10.72 57.66,12.12 57.66,17.32 58.52,18.19 69.09,18.19 70.32,19.42 70.32,20.46 ; R7.2 70.32,20.46 ; 70.32,20.46 72.23,20.46 R8.1
FB3: length 22.5
  Top Layer w0.254: R17.2 92.33,50.25 ; 92.33,50.25 R18.1 ; 92.33,50.25 91.91,49.83 81.41,49.83 80.39,48.82 80.39,44.88 82.42,42.85 v1(82.8,42.85)
H1BA: length 28.8
  Top Layer w0.254: 8.76,59.21 7.76,59.21 U11.1 8.56,58.82 8.75,58.63 v1(14.61,58.63) ; v1(18.29,41.96) KEY1.3
  Bottom Layer w0.254: v1(18.29,41.96) 18.29,54.95 v1(14.61,58.63)
H1BB: length 46
  Top Layer w0.254: v1(20.83,59.74) v1(24.77,59.74)
  Bottom Layer w0.254: v1(20.83,59.74) 20.83,60.63 16.51,64.95 11.81,64.95 8.19,61.33 U11.2 ; v1(25.38,36.88) 25.38,37.4 24.22,38.56 24.15,38.56 23.81,38.9 23.81,39.39 24.15,39.73 24.18,39.73 24.38,39.93 24.38,40.03 24.4,40.05 24.4,54.33 24.31,54.42 24.31,54.9 24.38,54.98 24.38,55.42 25.27,56.31 25.27,59.23 v1(24.77,59.74)
H2BA: length 12.9
  Top Layer w0.254: v1(18.29,40.69) KEY1.4 ; v1(14.35,40.69) 14.07,40.41 U15.1
  Bottom Layer w0.254: v1(14.35,40.69) v1(18.29,40.69)
H2BB: length 20.3
  Top Layer w0.254: v1(21.84,38.96) 22.02,39.14 v1(24.39,39.14) ; v1(14.61,42.09) 13.78,42.91 U15.2
  Bottom Layer w0.254: v1(25.45,38.15) 24.46,39.14 v1(24.39,39.14) ; v1(14.61,42.09) 17.34,42.09 18.05,41.38 18.53,41.38 20.94,38.96 v1(21.84,38.96)
H3BA: length 28
  Top Layer w0.254: KEY1.5 19.97,39.44 v1(18.29,39.44) ; U16.1 7.87,22.38 v1(15.11,22.38)
  Bottom Layer w0.254: v1(18.29,39.44) 16.51,37.66 16.51,23.77 v1(15.11,22.38)
H3BB: length 30.1
  Top Layer w0.254: U16.2 11.81,24.37 13.92,26.48 17.92,26.48 v1(18.54,27.1) ; KEY1.12 25.02,40.13 24.91,40.13 24.75,40.29 v1(23.82,40.29)
  Bottom Layer w0.254: v1(18.54,27.1) 22.02,30.58 22.21,30.58 22.79,31.16 22.79,31.41 23.19,31.81 23.19,39.66 v1(23.82,40.29)
H4BA: length 44.7
  Top Layer w0.254: KEY1.6 19.98,38.16 v1(18.29,38.16) ; v1(13.34,3.48) 12.93,3.07 U17.1
  Bottom Layer w0.254: v1(18.29,38.16) 18.29,38.15 17.02,36.88 17.02,23.29 16.26,22.53 16.26,6.4 v1(13.34,3.48)
H4BB: length 50.1
  Top Layer w0.254: KEY1.13 26.44,39.98 26.56,39.98 26.88,39.65 26.88,39.19 26.56,38.86 25.06,38.86 24.58,38.38 24.58,37.97 v1(24.26,37.64) ; U17.2 15.3,5.57 v1(19.56,9.83)
  Bottom Layer w0.254: v1(24.26,37.64) 24.26,14.53 23.57,13.84 23.57,12.64 23.23,12.29 22.02,12.29 v1(19.56,9.83)
M1: length 27.8
  Top Layer w0.254: 43.3,47.96 37.95,47.96 37.34,48.56 37.34,59.61 U19.4
M1+: length 8.3
  Top Layer w0.254: R9.2 28.31,66.33 U19.3 28.05,67.09 28.7,67.74 28.7,68.5 27.56,69.65 U5.3
M1-: length 8
  Top Layer w0.254: 27.55,68.39 27.54,68.38 v1(25.1,68.38) ; v1(24.86,64.44) 24.65,64.44 R10.1
  Bottom Layer w0.254: v1(24.86,64.44) 25.1,64.68 v1(25.1,68.38)
M1_CHS: length 27.5
  Top Layer w0.254: U1.15 43.22,48.44 41.27,48.44 38.23,51.49 38.23,61.39 31.23,68.39 29.85,68.39
M2: length 13.5
  Top Layer w0.254: 43.3,47.46 43.02,47.46 42.98,47.5 42.46,47.5 42.42,47.54 37.86,47.54 37.23,48.17 U20.4
M2+: length 8.3
  Top Layer w0.254: U4.3 26.74,49.4 27.54,50.2 28.07,50.2 28.48,49.78 28.48,48.5 28.15,48.17 U20.3 28,47.98 R11.2
M2-: length 7.3
  Top Layer w0.254: v1(27.9,49.48) 27.91,49.47 27.91,49.3 27.29,49.3 26.54,48.55 26.54,48.46 26.21,48.13 U4.2
  Bottom Layer w0.254: v1(28.06,53.39) 28.06,49.63 v1(27.9,49.48)
M2_CHS: length 24.6
  Top Layer w0.254: v1(48.26,46.91) 48.13,46.79 v1(46.86,46.79) ; U20.6 35.67,49.47 v1(35.94,49.2) ; v1(49.4,44.63) 49.4,43.77 48.83,43.2 48.83,42.5 U1.33
  Bottom Layer w0.254: v1(46.86,46.79) 45.28,48.37 44.56,48.37 43.73,49.2 38.8,49.2 38.72,49.28 38.24,49.28 38.16,49.2 v1(35.94,49.2) ; v1(48.26,46.91) 48.26,45.77 v1(49.4,44.63)
M3: length 23.7
  Top Layer w0.254: U21.4 30.45,29.5 30.79,29.83 30.79,30.18 35.56,34.95 35.56,40.18 42.33,46.96 43.3,46.96
M3+: length 10.3
  Top Layer w0.254: R13.2 29.78,27.53 U21.3 28.15,29.5 28.48,29.83 28.48,31.12 28.32,31.28 27.29,31.28 26.92,30.91 U7.3
M3-: length 9
  Top Layer w0.254: R14.1 25.57,24.91 v1(25.61,24.91) ; U7.2 26.3,29.64 27.29,30.63 27.64,30.63 U21.1
  Bottom Layer w0.254: v1(25.51,29.64) 25.61,29.55 v1(25.61,24.91)
M3_CHS: length 23.6
  Top Layer w0.254: 46.3,42.46 46.21,42.37 46.21,41.06 45.7,40.54 42.45,40.54 39.13,37.22 39.13,35.29 34.88,31.04 v1(33.91,31.04) ; v1(30.1,31.41) 30.11,31.4 U21.6
  Bottom Layer w0.254: v1(30.1,31.41) 33.54,31.41 v1(33.91,31.04)
M4: length 40.2
  Top Layer w0.254: U22.4 30.72,12.23 31.75,13.26 31.75,30.15 35.94,34.34 35.94,39.93 42.42,46.41 U1.19
M4+: length 9.3
  Top Layer w0.254: U8.3 28.17,14.56 29.08,13.64 29.08,12.75 28.56,12.23 U22.3 28.77,11.52 R15.2
M4-: length 7
  Top Layer w0.254: U22.1 27.89,13.36 27.54,13.36 27.48,13.29 v1(25.06,13.29) ; v1(25.04,10.52) 25.04,10.48 R16.1
  Bottom Layer w0.254: v1(25.04,10.52) 25.06,10.54 v1(25.06,13.29)
M4_CHS: length 39.4
  Top Layer w0.254: U22.6 30.49,13.66 v1(30.49,14.19) ; U1.27 45.75,41.42 v1(45.61,41.28)
  Bottom Layer w0.254: v1(30.49,14.19) 30.47,14.2 28.59,14.2 27.69,15.1 27.69,17.01 46.47,35.79 46.47,37.72 45.61,38.58 v1(45.61,41.28)
MOT1+: length 13.7
  Top Layer w1.016: U5.6 19.47,69.65 19.16,69.33 16.38,69.33 C6.1 13.88,71.33 U11.6
MOT1-: length 13.2
  Top Layer w1.016: U5.8 19.6,67.11 19.28,67.42 18.7,67.42 18.58,67.55 16.26,67.55 C6.2 15.37,67.68 14.73,68.32 7.87,68.32 U11.5
MOT2+: length 14.7
  Top Layer w1.016: U4.6 19.68,49.4 19.42,49.14 15.75,49.14 C7.1 11.47,52.91 U15.6
MOT2-: length 14.4
  Top Layer w1.016: U4.8 16.12,46.86 C7.2 15.21,47.77 15.03,47.77 14.97,47.82 14.77,47.82 14.38,48.21 14.38,48.41 12.96,49.83 11.68,49.83 11.11,50.41 U15.5
MOT3+: length 14.3
  Top Layer w1.016: U16.6 12.99,34.37 C8.1 19.67,30.6 U7.6
MOT3-: length 14.1
  Top Layer w1.016: U16.5 7.62,31.61 12.82,31.61 15.24,29.2 C8.2 18.32,29.2 18.83,28.69 19.67,28.69 U7.8
MOT4+: length 13.6
  Top Layer w1.016: 16.2,14.56 15.71,14.56 C9.1 ; 16.2,14.56 15.18,15.57 U17.6 ; 16.2,14.56 U8.6
MOT4-: length 13
  Top Layer w1.016: U17.5 15.62,13.07 C9.2 16.58,13.07 17.62,12.02 U8.8
MPU_INT: length 37.7
  Top Layer w0.254: 43.3,48.96 v1(44.8,48.96)
  Bottom Layer w0.254: 74.42,64.82 71.5,61.9 62.74,61.9 51.05,50.22 46.48,50.22 45.22,48.96 v1(44.8,48.96)
MPU_SCL: length 24.3
  Top Layer w0.254: 51.8,47.96 56.29,47.96 59.84,51.51 R2.1 73.81,51.51 74.42,52.12
MPU_SDA: length 25.2
  Top Layer w0.254: 51.8,48.46 54.25,48.46 58.8,53.01 67.42,53.01 R1.1 74.31,54.55 74.42,54.66
PRX3: length 17.5
  Top Layer w0.254: 43.3,45.46 44.9,45.46 v1(44.96,45.52)
  Bottom Layer w0.254: v1(44.96,45.52) 44.83,45.39 37.59,45.39 35.31,43.1 H6.3
PTX3: length 16.4
  Top Layer w0.254: U1.22 43.16,44.82 42.3,44.82 41.34,43.87 41.34,43 41.02,42.68 41.02,42.6 40.43,42 39.58,42 39.23,41.66 39.23,40.81 38.48,40.06 v1(36.96,40.06) ; 30.1,40.56 31.07,40.56 v1(31.5,40.14)
  Bottom Layer w0.254: v1(31.5,40.14) 36.87,40.14 v1(36.96,40.06)
RSTP: length 27.5
  Top Layer w0.254: R4.2 64.16,57.34 H5.2 ; 47.3,50.96 v1(47.3,49.12)
  Bottom Layer w0.254: H5.2 55,48.18 53.78,48.18 53.53,48.44 47.98,48.44 v1(47.3,49.12)
SERVO1: length 19.6
  Top Layer w0.254: H10.3 60.58,38.41 60.58,41.2 ; U1.32 48.16,42.5 48.16,43.2 48.39,43.42 v1(48.39,43.87)
  Bottom Layer w0.254: v1(48.39,43.87) 57.53,43.87 60.58,40.82
SERVO2: length 28.3
  Top Layer w0.254: v1(55.37,45.01) 55.37,41.45 v1(55.75,41.07) 60.83,35.99 H9.3 ; 46.8,42.46 46.74,42.52 v1(46.74,43.99)
  Bottom Layer w0.254: v1(46.74,43.99) 47.63,44.88 47.63,47.17 48.22,47.76 49.38,47.76 50.85,46.29 54.09,46.29 v1(55.37,45.01)
SWCLK: length 6.8
  Top Layer w0.254: 51.8,43.96 51.8,39.92 H3.3
SWDIO: length 5.3
  Top Layer w0.254: H3.2 49.3,39.88 49.3,42.46
XCL: length 11.9
  Top Layer w0.254: 74.42,59.74 78.77,59.74 78.88,59.63 79.36,59.63 79.47,59.74 H7.3
XDA: length 11.8
  Top Layer w0.254: H7.4 74.42,57.2
$2N1258: length 17.1
  Top Layer w0.254: 48.3,50.96 48.3,51.96 48.25,52.01 48.25,59.41 48.63,59.79 51.88,59.79 ; 51.88,59.79 X1.2 ; 51.88,59.79 52.32,60.23 C15.2
$2N1262: length 17.2
  Top Layer w0.254: C14.2 43.94,60.12 X1.1 47.47,59.79 47.85,59.41 47.85,52.01 47.8,51.96 47.8,50.96
$2N7414: length 18.8
  Top Layer w1.016: U9.2 42.61,73.9 43.69,72.82 52.28,72.82 D1.1 55.63,76.17 L1.1
$2N13978: length 12.6
  Top Layer w0.254: U18.2 55.96,13.05
  Top Layer w1.016: v2(58.55,6.91) 58.55,4.54 D2.1
  Bottom Layer w1.016: v2(58.55,6.91) 58.72,7.08 58.72,12.12
  Bottom Layer w1.27: 58.72,12.12 57.83,13 v2(56.01,13)
$2N27693: length 10.7
  Top Layer w0.254: v3(86.74,39.17) 87.33,39.17 87.63,39.47
  Bottom Layer w1.016: 77.34,39.13 77.46,39.25 79.52,39.25 79.76,39.48 82.04,39.48 82.28,39.25 U23.2
  Bottom Layer w1.27: v3(86.74,39.17) 86.61,39.17 86.54,39.25 U23.2
$2N41129: length 97.2
  Top Layer w1.27: U24.+ 93.05,91.92 97.54,87.43 97.54,35.7 C36.1
  Bottom Layer w1.27: C36.1 89.48,32.02 U23.1 83.69,37.55 83.33,37.91 81.92,37.91 81.87,37.96 81.03,37.96 C37.2
  Bottom Layer w2.54: F1.2 75.99,89.79 87.67,89.79 89.79,91.92 U24.+

## Copper pours and planes (outline as drawn; the poured copper is in the pictures)
GND on Top Layer: 0,99.52 99.63,99.52 99.63,0 0,0
GND on Bottom Layer: 0.13,99.51 99.76,99.51 99.76,0.69 0.13,0.69

Small or netless copper shapes (teardrops, artwork), in the pictures only: 366 on Top Layer, 154 on Bottom Layer

## Text on the board
Bottom Silkscreen Layer: 106 | LM2596 | 104 | 33uh
Top Silkscreen Layer: 12pf | 106 | 1K | LM2596-ADJ | 10000uf 35v | SERVO1B | SERVO2 | SERVO1A | 8.56K | 680 | 33uH | 2K | 6.18K | 104x7r | 104 | DRV8870_1 | DRV8870_4 | 680uf | DRV8870_3 | DRV8870_2 | UART2 | CH443K | +3.3 | - | 3.3V+ | UART1 | + | 32F103C8 | SS34 | G | 3.3 | DEBUG | 10K | BOOT0 | 220uf | SDA | 3.3v | INT | SCL | 3.3V | IO00 | UART3 | MPU6050 | CH444 | SWDIO | SWCLK | HMC5883L | VIN | M2- | GND/V- | ESP32 | AIO Board | V1.3 | GND | 12v+ | M3 | M1 | M4 | M2 | 设备TX | 设备RX | 8M晶振 | ESP32预留单边插座 | 340的RX | 340的TX
